# Altium schematic sheet main.SchDoc
size A4; SheetNumber: 1; SheetTotal: 8
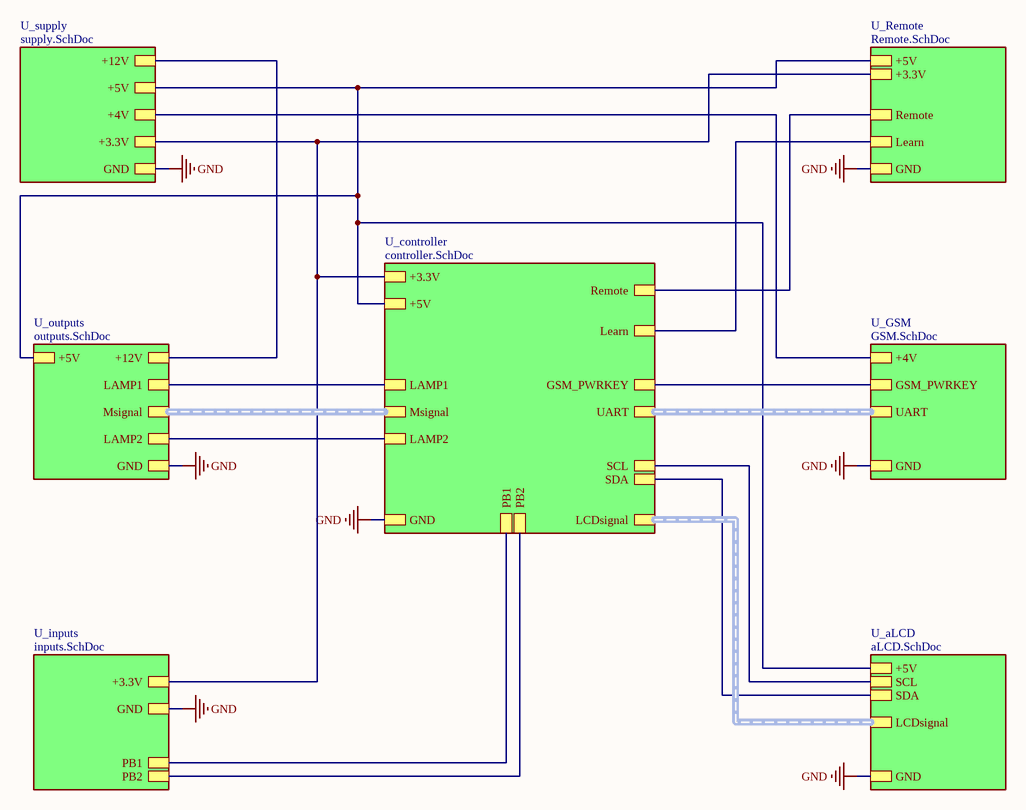
[diagram p0: main.SchDoc]

## Sub-sheets
U_aLCD = aLCD.SchDoc: +5V, GND, LCDsignal (harness LCDsignal), SCL, SDA
U_controller = controller.SchDoc: +3.3V, GND, Msignal (harness Msignal), LCDsignal (harness LCDsignal), UART (harness UART), Remote, LAMP1, LAMP2, PB1, PB2, +5V, Learn, GSM_PWRKEY, SCL, SDA
U_GSM = GSM.SchDoc: +4V, GND, UART (harness UART), GSM_PWRKEY
U_inputs = inputs.SchDoc: GND, +3.3V, PB1, PB2
U_outputs = outputs.SchDoc: +12V, GND, Msignal (harness Msignal), +5V, LAMP1, LAMP2
U_Remote = Remote.SchDoc: +5V, GND, Remote, Learn, +3.3V
U_supply = supply.SchDoc: +12V, +5V, +4V, +3.3V, GND

## Nets
GND: sheet U_aLCD/GND, sheet U_controller/GND, sheet U_GSM/GND, sheet U_inputs/GND, sheet U_outputs/GND, sheet U_Remote/GND, sheet U_supply/GND
(unnamed): sheet U_aLCD/+5V, sheet U_controller/+5V, sheet U_outputs/+5V, sheet U_Remote/+5V, sheet U_supply/+5V
(unnamed): sheet U_aLCD/SCL, sheet U_controller/SCL
(unnamed): sheet U_aLCD/SDA, sheet U_controller/SDA
(unnamed): sheet U_controller/+3.3V, sheet U_inputs/+3.3V, sheet U_Remote/+3.3V, sheet U_supply/+3.3V
(unnamed): sheet U_controller/Remote, sheet U_Remote/Remote
(unnamed): sheet U_controller/LAMP1, sheet U_outputs/LAMP1
(unnamed): sheet U_controller/LAMP2, sheet U_outputs/LAMP2
(unnamed): sheet U_controller/PB1, sheet U_inputs/PB1
(unnamed): sheet U_controller/PB2, sheet U_inputs/PB2
(unnamed): sheet U_controller/Learn, sheet U_Remote/Learn
(unnamed): sheet U_controller/GSM_PWRKEY, sheet U_GSM/GSM_PWRKEY
(unnamed): sheet U_GSM/+4V, sheet U_supply/+4V
(unnamed): sheet U_outputs/+12V, sheet U_supply/+12V

## Buses and harness runs
harness sheet U_aLCD/LCDsignal = sheet U_controller/LCDsignal
harness sheet U_controller/Msignal = sheet U_outputs/Msignal
harness sheet U_controller/UART = sheet U_GSM/UART